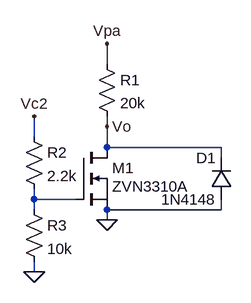
[diagram p0: schematic mosfet_output.asc]
mosfet_output.asc, the LTspice schematic file:
Version 4
SHEET 1 880 680
WIRE 128 0 128 -32
WIRE 128 96 128 80
WIRE 16 112 16 80
WIRE 128 128 128 96
WIRE 304 128 128 128
WIRE 304 144 304 128
WIRE 16 208 16 192
WIRE 80 208 16 208
WIRE 16 224 16 208
WIRE 304 224 304 208
WIRE 304 224 128 224
WIRE 128 240 128 224
WIRE 16 320 16 304
FLAG 128 240 0
FLAG 128 -32 Vpa
FLAG 128 96 Vo
FLAG 16 320 0
FLAG 16 80 Vc2
SYMBOL nmos 80 128 R0
WINDOW 3 56 60 Left 2
SYMATTR Value ZVN3310A
SYMATTR InstName M1
SYMATTR Prefix X
SYMBOL res 112 -16 R0
SYMATTR InstName R1
SYMATTR Value 20k
SYMBOL diode 320 208 R180
WINDOW 0 24 64 Left 2
WINDOW 3 24 0 Left 2
SYMATTR InstName D1
SYMATTR Value 1N4148
SYMBOL res 0 96 R0
SYMATTR InstName R2
SYMATTR Value 2.2k
SYMBOL res 0 208 R0
SYMATTR InstName R3
SYMATTR Value 10k

The netlist it stands for:
* mosfet_output.asc
XM1 Vo N001 0 ZVN3310A  ; pins D G S
R1 Vpa Vo 20k
D1 0 Vo 1N4148
R2 Vc2 N001 2.2k
R3 N001 0 10k
.model D D
.lib standard.dio
.backanno
.end